# EAGLE design 6packRev1D (EAGLE 9.2.0)
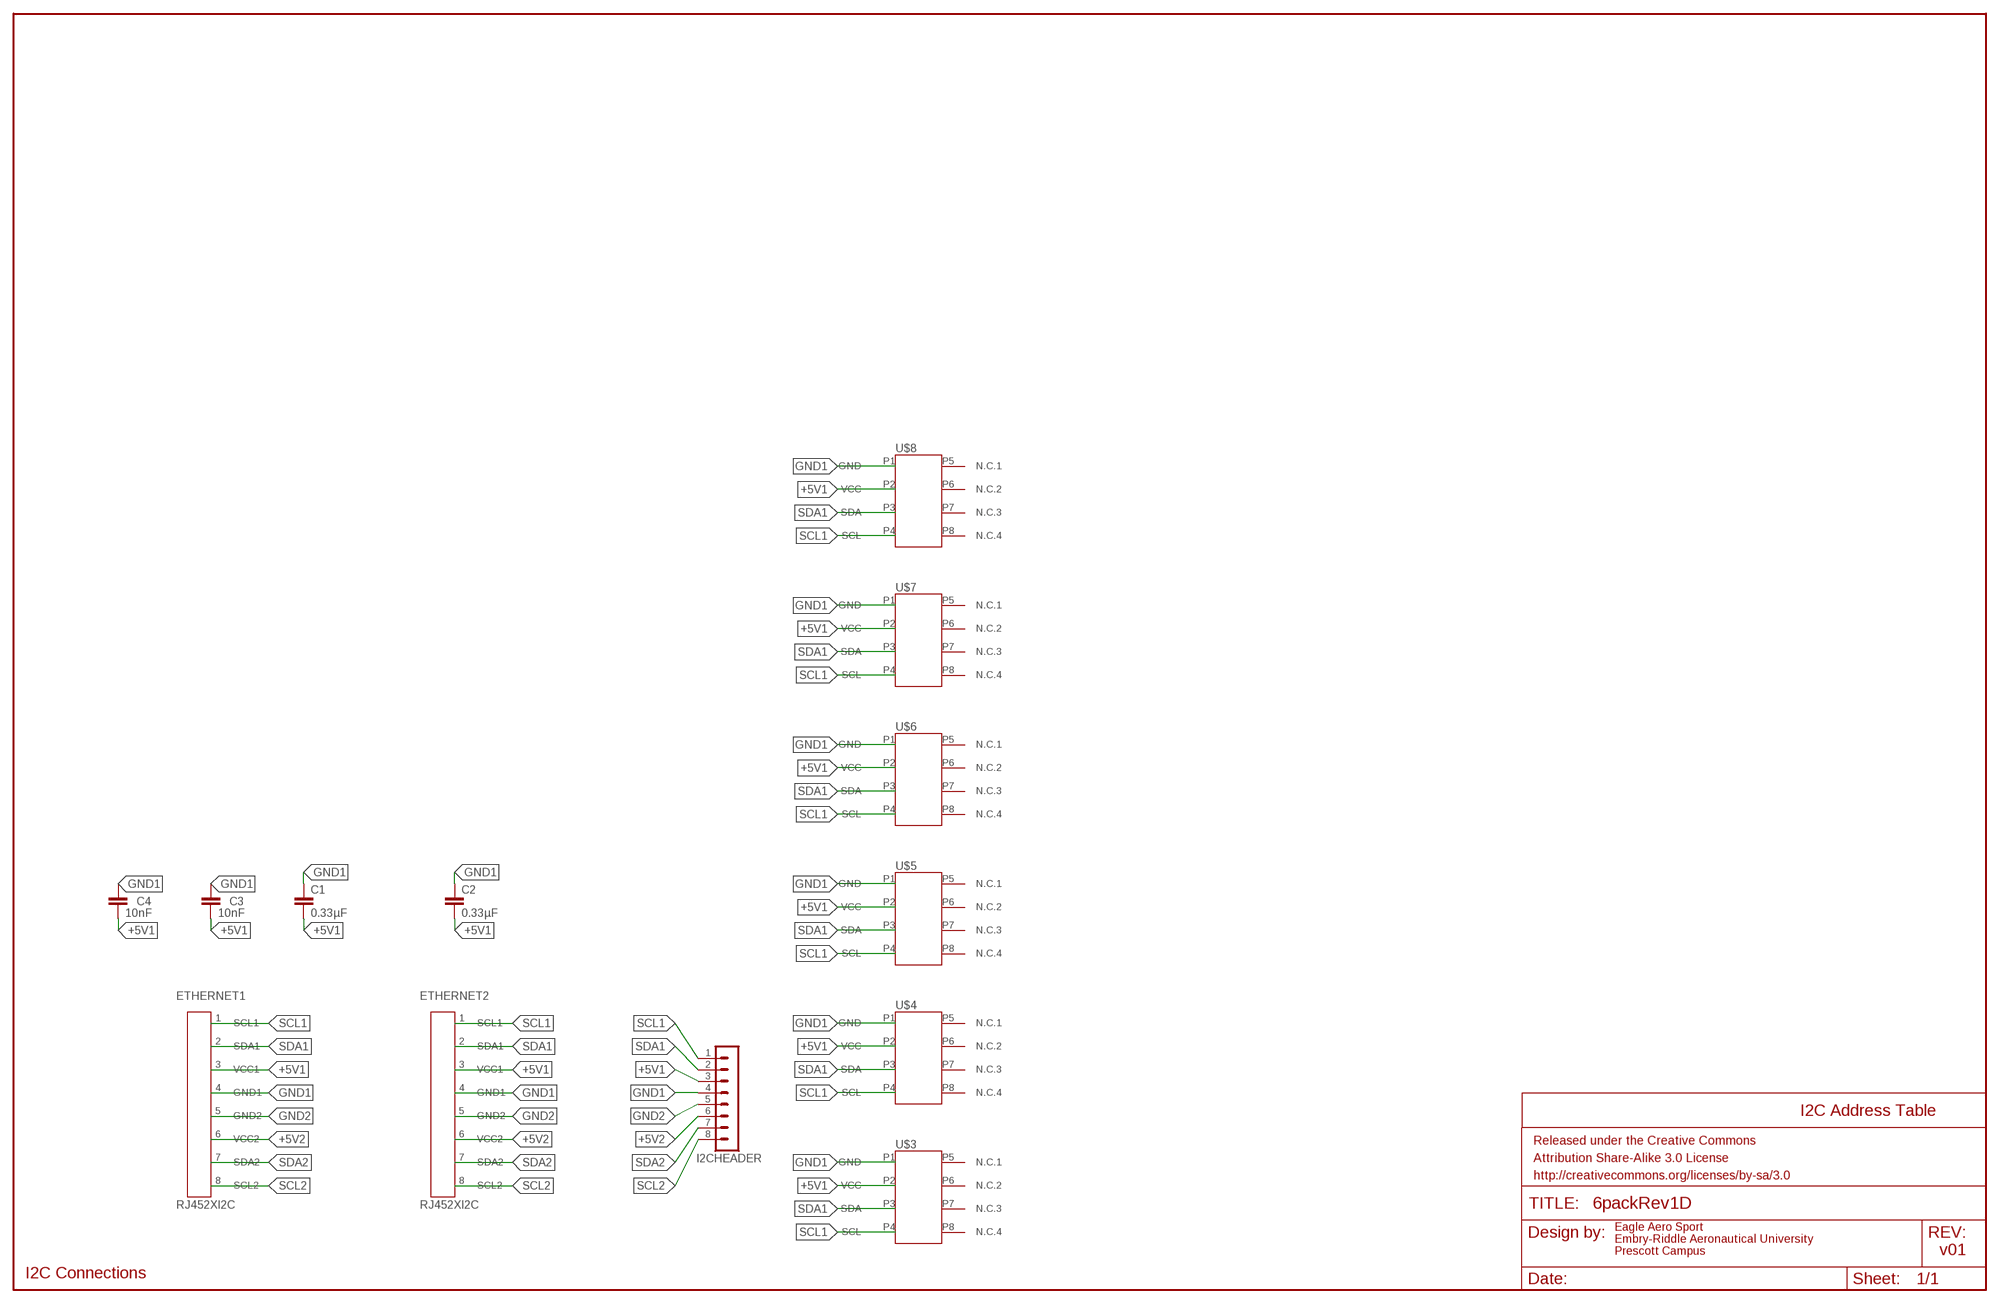
[diagram p0: schematic, sheet 1]

## Parts
C1  0.33µF  0.33UF/330NF-0805-50V-10%  [0805]
C2  0.33µF  0.33UF/330NF-0805-50V-10%  [0805]
C3  10nF  10NF-PTH-10MM-10000V-1-%  [CAP-PTH-10MM]
C4  10nF  10NF-PTH-10MM-10000V-1-%  [CAP-PTH-10MM]
ETHERNET1  RJ452XI2C  [RJ45-8]
ETHERNET2  RJ452XI2C  [RJ45-8]
FRAME1  FRAME-LEDGER  [CREATIVE_COMMONS]
I2CHEADER  MA08-1  [MA08-1]
U$3  AMS5915  [DIP8W]
U$4  AMS5915  [DIP8W]
U$5  AMS5915  [DIP8W]
U$6  AMS5915  [DIP8W]
U$7  AMS5915  [DIP8W]
U$8  AMS5915  [DIP8W]

## Nets
+5V1: C1.2 C2.2 C3.2 C4.2 ETHERNET1.3(VCC1) ETHERNET2.3(VCC1) I2CHEADER.3 U$3.P2(VCC) U$4.P2(VCC) U$5.P2(VCC) U$6.P2(VCC) U$7.P2(VCC) U$8.P2(VCC)
+5V2: ETHERNET1.6(VCC2) ETHERNET2.6(VCC2) I2CHEADER.6
GND1: C1.1 C2.1 C3.1 C4.1 ETHERNET1.4(GND1) ETHERNET2.4(GND1) I2CHEADER.4 U$3.P1(GND) U$4.P1(GND) U$5.P1(GND) U$6.P1(GND) U$7.P1(GND) U$8.P1(GND)
GND2: ETHERNET1.5(GND2) ETHERNET2.5(GND2) I2CHEADER.5
SCL1: ETHERNET1.1(SCL1) ETHERNET2.1(SCL1) I2CHEADER.1 U$3.P4(SCL) U$4.P4(SCL) U$5.P4(SCL) U$6.P4(SCL) U$7.P4(SCL) U$8.P4(SCL)
SCL2: ETHERNET1.8(SCL2) ETHERNET2.8(SCL2) I2CHEADER.8
SDA1: ETHERNET1.2(SDA1) ETHERNET2.2(SDA1) I2CHEADER.2 U$3.P3(SDA) U$4.P3(SDA) U$5.P3(SDA) U$6.P3(SDA) U$7.P3(SDA) U$8.P3(SDA)
SDA2: ETHERNET1.7(SDA2) ETHERNET2.7(SDA2) I2CHEADER.7
Unconnected: U$3.P5(N.C.1) U$3.P6(N.C.2) U$3.P7(N.C.3) U$3.P8(N.C.4) U$4.P5(N.C.1) U$4.P6(N.C.2) U$4.P7(N.C.3) U$4.P8(N.C.4) U$5.P5(N.C.1) U$5.P6(N.C.2) U$5.P7(N.C.3) U$5.P8(N.C.4) U$6.P5(N.C.1) U$6.P6(N.C.2) U$6.P7(N.C.3) U$6.P8(N.C.4) U$7.P5(N.C.1) U$7.P6(N.C.2) U$7.P7(N.C.3) U$7.P8(N.C.4) U$8.P5(N.C.1) U$8.P6(N.C.2) U$8.P7(N.C.3) U$8.P8(N.C.4)

## Notes on the sheet
- I2C Address Table
- Eagle Aero Sport
  Embry-Riddle Aeronautical University
  Prescott Campus
- v01
- I2C Connections

## Library data of the parts
C1 C2 = SparkFun-Capacitors:0.33UF/330NF: 0.33µF/330nF ceramic capacitors A capacitor is a passive two-terminal electrical component used to store electrical energy temporarily in an electric field.; PROD_ID: CAP-08469
C3 C4 = SparkFun-Capacitors:10NF: 0.01uF/10nF/10,000pF ceramic capacitors A capacitor is a passive two-terminal electrical component used to store electrical energy temporarily in an electric field. CAP-09321; PROD_ID: CAP-09321
ETHERNET1 ETHERNET2 = untitled:RJ452XI2C
FRAME1 = SparkFun-Aesthetics:FRAME-LEDGER: Schematic Frame Standard 11x14 US Ledger frame
I2CHEADER = con-lstb:MA08-1: PIN HEADER; OC_FARNELL: unknown; OC_NEWARK: unknown
U$3-U$8 = untitled:AMS5915

## Net classes
0 default: width 0.762 mm, clearance 0.762 mm

## Board
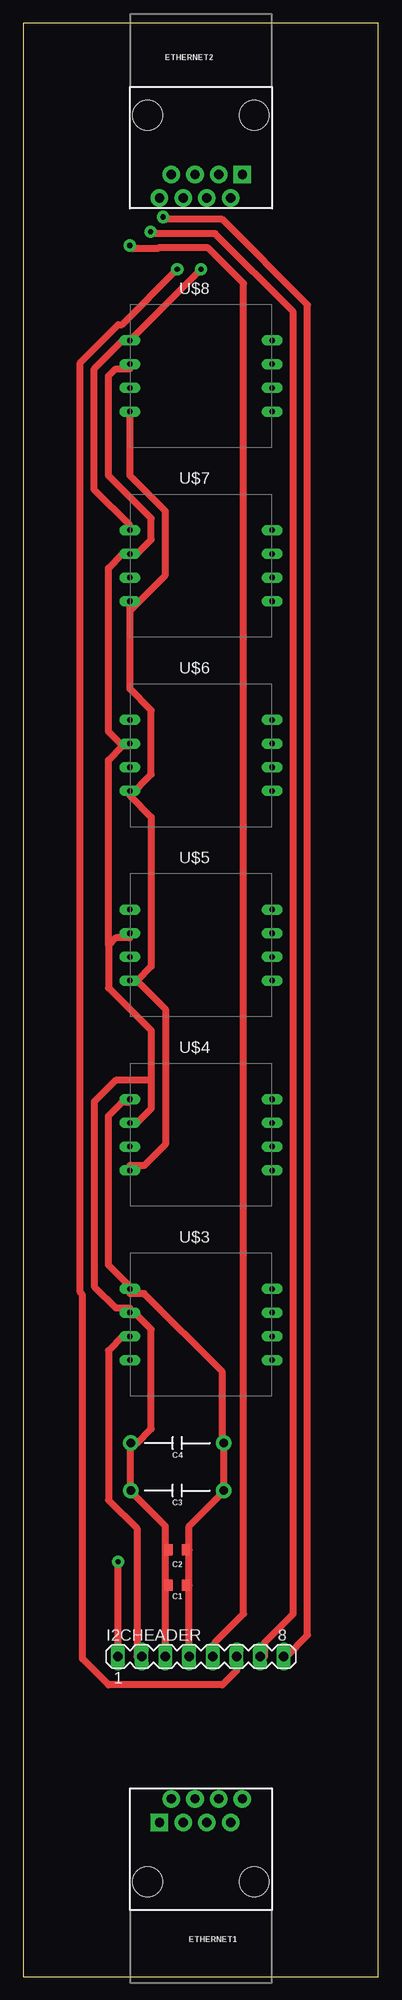
[diagram p1: board, top side]
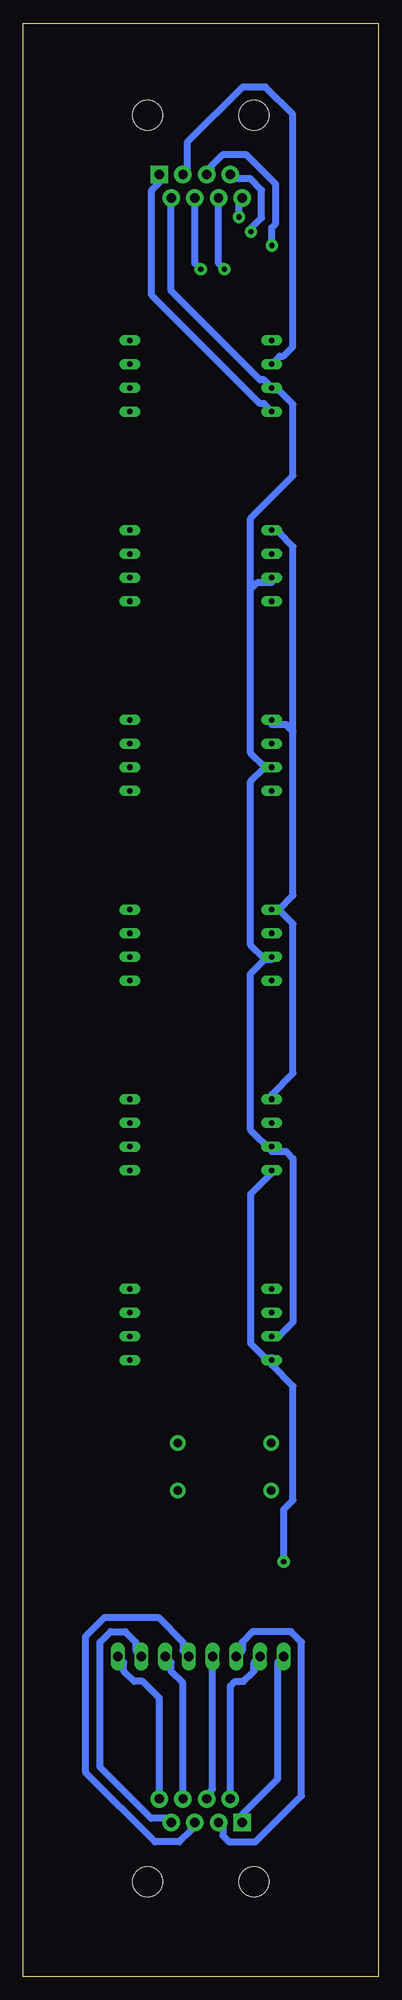
[diagram p2: board, bottom side, seen from below]

Size 38.08 x 209.22 mm. Coordinates in mm from the lower left corner, seen from the top.
Outline: 0,0 38.08,0 38.08,209.22 0,209.22 0,0
Copper layers (1*16): Top 0.035mm / dielectric 1.5mm / Bottom 0.035mm
Design rules "default": minimum track width 6mil, minimum drill 0.35mm, track to track 6mil, track to pad 6mil, pad to pad 6mil, via to via 6mil, smd to smd 6mil, copper to edge 40mil, drill to drill 6mil, minimum pad ring 10mil, minimum via ring 8mil, stop-mask expansion 4mil, vias tented up to drill 0mil, thermal gap 10mil

### Footprints (pad centres in the part's own frame; a part is rotated, then mirrored left to right if it is on the bottom)
0805 = smd 0.8 x 1.2: 1 -0.9,0; 2 0.9,0
CAP-PTH-10MM = drill 0.9 pad 1.651: 1 -5,0; 2 5,0
RJ45-8 = drill 1 pad 1.88 square: 1 -4.445,6.35 | drill 1 pad 1.88: 2 -3.175,8.89; 3 -1.905,6.35; 4 -0.635,8.89; 5 0.635,6.35; 6 1.905,8.89; 7 3.175,6.35; 8 4.445,8.89 | hole 3.2: -5.715,0; 5.715,0
MA08-1 = drill 1.016 long: 1 -8.89,0; 2 -6.35,0; 3 -3.81,0; 4 -1.27,0; 5 1.27,0; 6 3.81,0; 7 6.35,0; 8 8.89,0
DIP8W = drill 0.6 long: P1 -7.62,3.81; P2 -7.62,1.27; P3 -7.62,-1.27; P4 -7.62,-3.81; P5 7.62,-3.81; P6 7.62,-1.27; P7 7.62,1.27; P8 7.62,3.81

### Placement (x,y rotation side)
C1  16.51,41.91 180 top
C2  16.51,45.72 180 top
C3  16.51,52.07 180 top
C4  16.51,57.15 180 top
ETHERNET1  19.05,10.16 0 top
ETHERNET2  19.05,199.39 180 top
FRAME1  -77.47,62.23 0 top  (outside the outline)
I2CHEADER  19.05,34.29 0 top
U$3  19.05,69.85 0 top
U$4  19.05,90.17 0 top
U$5  19.05,110.49 0 top
U$6  19.05,130.81 0 top
U$7  19.05,151.13 0 top
U$8  19.05,171.45 0 top

### Tracks (layer width: path | path; a pad name or v marks a point on that pad's centre or on a via)
+5V1
  Top 0.762: I2CHEADER.3 15.24,41.91 | 15.24,41.91 15.24,45.72 | 15.24,45.72 15.24,48.26 11.51,51.99 C3.2 C4.2 12.19,57.15 13.72,58.67 13.72,69.34 12.19,70.87 11.43,70.87 U$3.P2 11.43,71.63 9.91,71.63 7.62,73.91 7.62,93.73 9.91,96.01 13.72,96.01 | C1.2 15.24,41.91 | C2.2 15.24,45.72 | U$4.P2 12.19,91.44 13.72,92.96 13.72,96.01 | 13.72,96.01 13.72,101.35 9.14,105.92 9.14,110.49 | 9.14,110.49 9.91,111.25 11.43,111.25 U$5.P2 | 10.67,131.83 11.43,131.83 U$6.P2 10.67,131.83 | 10.67,131.83 9.14,130.3 9.14,110.49 | 10.67,131.83 9.14,133.35 9.14,150.88 10.67,152.4 U$7.P2 12.19,152.4 13.72,153.92 13.72,156.21 9.14,160.78 9.14,171.45 9.91,172.21 11.43,172.21 U$8.P2
  Bottom 0.762: U$8.P2 10.59,173.56 10.17,173.56 9.18,174.56 9.18,199.47 12.09,202.39 14.58,202.39 20.5,196.47 20.5,193.5 ETHERNET2.3 | ETHERNET1.3 16.69,16.05 16.69,15.1 16.02,14.43 13.19,14.43 8.26,19.36 8.26,35.84 9.37,36.96 13.49,36.96 14.61,35.84 14.61,34.92 I2CHEADER.3
+5V2  (via drill 0.55 pad 1.3)
  Top 0.762: I2CHEADER.6 22.86,32.77 21.34,31.24 9.14,31.24 6.35,34.04 6.35,73.03 6.1,73.28 6.1,172.88 10.17,176.96 10.59,176.96 v16.51,182.88
  Bottom 0.762: 16.76,190.5 ETHERNET2.6 17.14,183.51 v16.51,182.88 | I2CHEADER.6 22.23,33.66 22.23,32.74 20.95,31.47 ETHERNET1.6
GND1  (via drill 0.55 pad 1.3)
  Top 0.762: I2CHEADER.4 17.78,41.91 | 17.78,41.91 17.78,45.72 | 17.78,45.72 17.78,48.26 21.51,51.99 C3.1 C4.1 21.34,57.15 21.34,64.77 12.95,73.15 11.43,73.15 U$3.P1 11.43,73.91 9.14,76.2 9.14,92.2 10.67,93.73 11.43,93.73 U$4.P1 | C2.1 17.78,45.72 | C1.1 17.78,41.91 | v19.05,182.88 U$8.P1 10.67,175.26 7.62,172.21 7.62,159.26 11.43,155.45 U$7.P1
  Bottom 0.762: 17.78,33.02 I2CHEADER.4 17.78,20.09 17.96,19.91 17.96,19.51 ETHERNET1.4 | v19.05,182.88 19.68,183.51 ETHERNET2.4 | 10.67,114.3 9.14,112.78 9.14,96.77 11.43,94.49 U$4.P1 | 9.14,133.35 9.91,134.11 11.43,134.11 U$6.P1 | 9.14,133.35 9.14,115.82 10.67,114.3 | 10.67,114.3 U$5.P1 | 9.14,133.35 9.14,153.16 10.67,154.69 11.43,154.69 U$7.P1
GND2  (via drill 0.55 pad 1.3)
  Top 0.762: I2CHEADER.5 20.57,34.29 20.57,35.81 23.62,38.86 23.62,181.36 19.81,185.17 14.48,185.17 14.4,185.09 11.76,185.09 v11.43,185.42
  Bottom 0.762: ETHERNET2.5 17.96,193.5 17.96,193.9 16.74,195.12 14.13,195.12 11,191.99 11,187.76 11.43,187.33 v11.43,185.42 | ETHERNET1.5 20.14,16.05 20.14,15.65 21.36,14.43 23.97,14.43 31.37,21.82 31.37,36.47 29.36,38.48 23.59,38.48 20.95,35.84 20.95,34.92 I2CHEADER.5
SCL1  (via drill 0.55 pad 1.3)
  Top 0.762: 12.19,106.68 13.72,108.2 13.72,124.21 11.43,126.49 | 11.43,146.3 11.43,137.92 13.72,135.64 13.72,128.78 11.43,126.49 | 11.43,146.3 U$7.P4 | 11.43,126.49 U$6.P4 | 12.19,106.68 15.24,103.63 15.24,89.15 12.95,86.87 11.43,86.87 U$4.P4 | 12.19,106.68 U$5.P4 | 9.91,34.29 I2CHEADER.1 v10.16,44.45 | U$8.P4 11.43,160.78 15.24,156.97 15.24,150.11 11.43,146.3
  Bottom 0.762: U$4.P4 11.43,86.11 13.72,83.82 13.72,67.82 12.19,66.29 11.43,66.29 U$3.P4 11.43,65.53 9.14,63.25 9.14,51.05 10.16,50.04 v10.16,44.45 | U$8.P4 12.27,168.48 12.69,168.48 24.31,180.1 24.31,191.36 23.5,192.18 ETHERNET2.1 | ETHERNET1.1 14.61,17.37 10.79,21.18 10.79,33.66 I2CHEADER.1
SCL2  (via drill 0.55 pad 1.3)
  Top 0.762: I2CHEADER.8 28.19,34.29 30.48,36.58 30.48,179.07 21.34,188.21 15.24,188.21 v14.97,188.48
  Bottom 0.762: v14.97,188.48 14.97,190.13 ETHERNET2.8 | ETHERNET1.8 23.5,29.84 25.27,31.62 26.19,31.62 27.3,32.74 27.3,33.66 I2CHEADER.8
SDA1
  Top 0.762: U$3.P3 10.67,68.58 9.14,67.06 9.14,51.05 12.19,48.01 12.19,34.29 I2CHEADER.2
  Bottom 0.762: U$3.P3 10.67,68.58 9.14,70.1 9.14,87.63 9.91,88.39 11.43,88.39 | 12.19,108.97 11.43,108.97 U$5.P3 12.19,108.97 | 12.19,108.97 13.72,107.44 13.72,90.68 11.43,88.39 | 11.43,88.39 U$4.P3 | 12.19,129.54 13.72,128.02 13.72,110.49 12.19,108.97 | 13.72,148.59 12.95,149.35 11.43,149.35 U$7.P3 | 13.72,148.59 13.72,131.06 12.19,129.54 | 12.19,129.54 U$6.P3 | 13.72,148.59 13.72,156.21 9.14,160.78 9.14,168.4 10.67,169.93 11.43,169.93 U$8.P3 12.27,171.02 12.69,171.02 22.23,180.56 ETHERNET2.2 | ETHERNET1.2 15.88,31.11 15.37,31.62 14.45,31.62 13.34,32.74 13.34,33.66 I2CHEADER.2
SDA2  (via drill 0.55 pad 1.3)
  Top 0.762: I2CHEADER.7 25.91,34.29 25.91,35.81 28.96,38.86 28.96,178.31 20.57,186.69 14.23,186.69 14.04,186.88 v13.66,186.88
  Bottom 0.762: v13.66,186.88 13.66,187.26 12.52,188.4 12.52,191.36 13.74,192.58 15.42,192.58 ETHERNET2.7 | ETHERNET1.7 22.68,16.97 24.36,16.97 29.84,22.45 29.84,35.84 28.73,36.96 27.15,36.96 26.04,35.84 26.04,34.92 I2CHEADER.7